# EAGLE design i27_adapt (EAGLE 6.5.0)
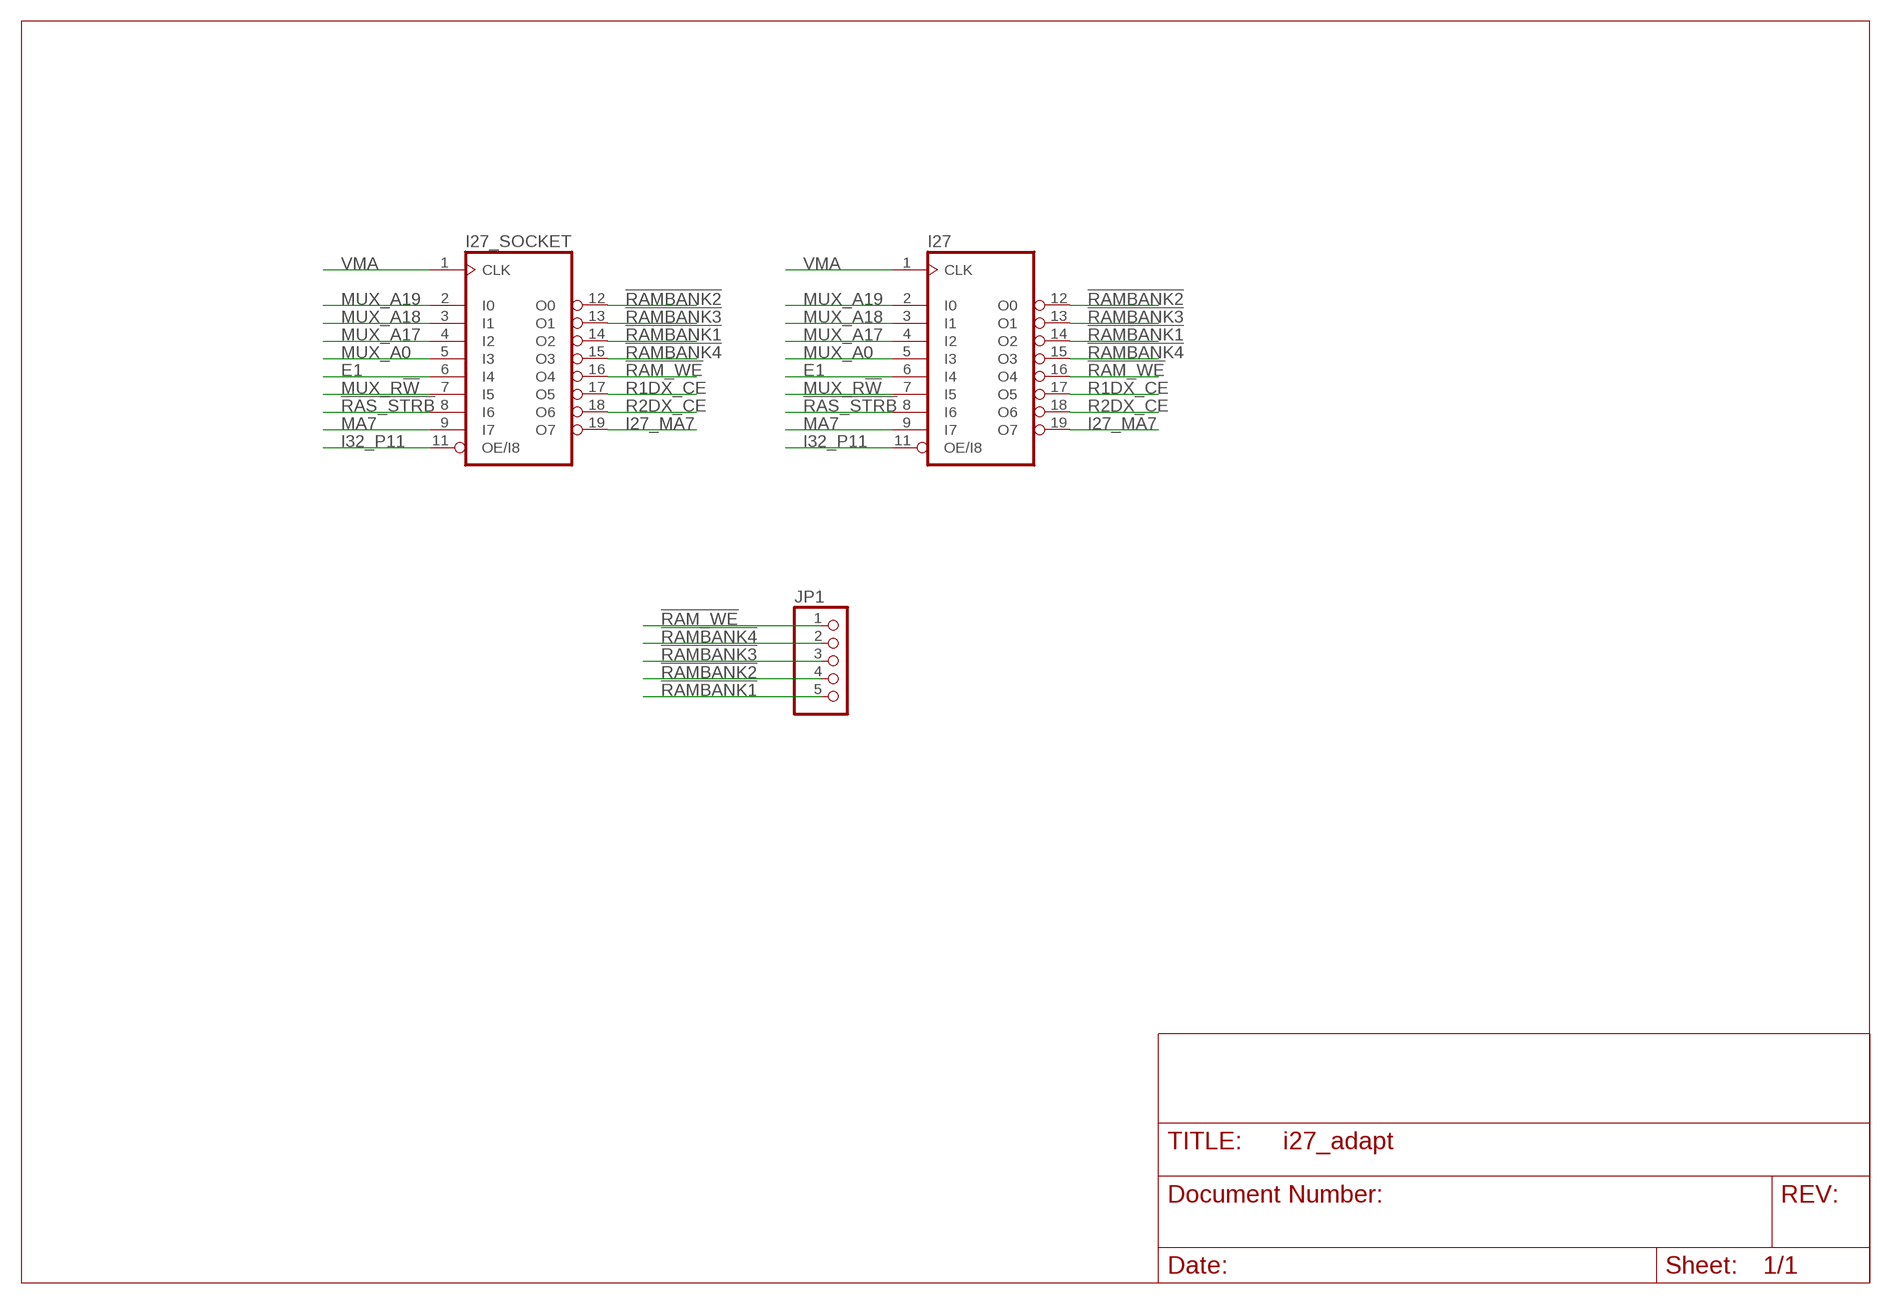
[diagram p0: schematic, sheet 1]

## Parts
I27  16V8-ROUND  [DIL20-R]
I27_SOCKET  16V8-ROUND  [DIL20-R]
JP1  PINHD-1X5/90  [1X05/90]

## Nets
!RAM_WE: I27.16(O4) I27_SOCKET.16(O4) JP1.1
!RAMBANK1: I27.14(O2) I27_SOCKET.14(O2) JP1.5
!RAMBANK2: I27.12(O0) I27_SOCKET.12(O0) JP1.4
!RAMBANK3: I27.13(O1) I27_SOCKET.13(O1) JP1.3
!RAMBANK4: I27.15(O3) I27_SOCKET.15(O3) JP1.2
!RAS_STRB: I27.8(I6) I27_SOCKET.8(I6)
E1: I27.6(I4) I27_SOCKET.6(I4)
I27_MA7: I27.19(O7) I27_SOCKET.19(O7)
I32_P11: I27.11(OE/I8) I27_SOCKET.11(OE/I8)
MA7: I27.9(I7) I27_SOCKET.9(I7)
MUX_A0: I27.5(I3) I27_SOCKET.5(I3)
MUX_A17: I27.4(I2) I27_SOCKET.4(I2)
MUX_A18: I27.3(I1) I27_SOCKET.3(I1)
MUX_A19: I27.2(I0) I27_SOCKET.2(I0)
MUX_R!W!: I27.7(I5) I27_SOCKET.7(I5)
R1DX_CE: I27.17(O5) I27_SOCKET.17(O5)
R2DX_CE: I27.18(O6) I27_SOCKET.18(O6)
VMA: I27.1(CLK) I27_SOCKET.1(CLK)

## Power pins joined to a net without a drawn wire
GND: I27.10(GND) I27_SOCKET.10(GND)
VCC: I27.20(VCC) I27_SOCKET.20(VCC)

## Library data of the parts
I27 I27_SOCKET = pal-phs:16V8: PAL
JP1 = pinhead-round:PINHD-1X5: PIN HEADER

## Board
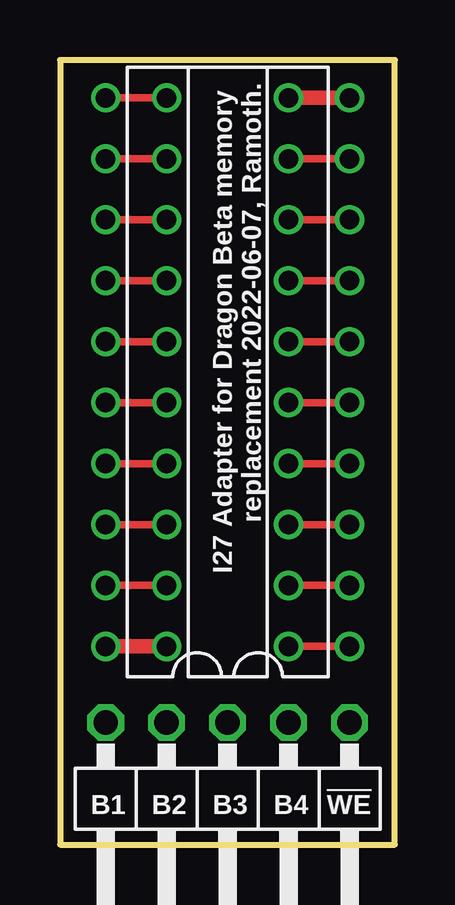
[diagram p1: board, top side]
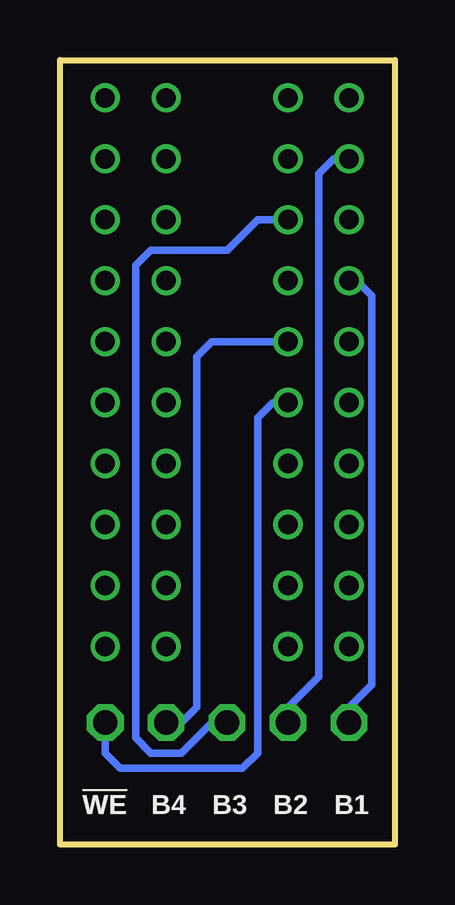
[diagram p2: board, bottom side, seen from below]

Size 13.95 x 32.69 mm. Coordinates in mm from the lower left corner, seen from the top.
Outline: 0,0 13.95,0 13.95,32.69 0,32.69 0,0
Copper layers (1*16): Top 0.035559375mm / dielectric 1.6mm / Bottom 0.035559375mm
Design rules "oshpark-2layer": minimum track width 6mil, minimum drill 10mil, track to track 6mil, track to pad 6mil, pad to pad 6mil, via to via 6mil, smd to smd 6mil, copper to edge 15mil, drill to drill 6mil, minimum pad ring 5mil, minimum via ring 5mil, stop-mask expansion 2.5mil, vias tented up to drill 0mil, thermal gap 10mil

### Footprints (pad centres in the part's own frame; a part is rotated, then mirrored left to right if it is on the bottom)
DIL20-R = drill 0.813: 1 -11.43,-3.81; 2 -8.89,-3.81; 3 -6.35,-3.81; 4 -3.81,-3.81; 5 -1.27,-3.81; 6 1.27,-3.81; 7 3.81,-3.81; 8 6.35,-3.81; 9 8.89,-3.81; 10 11.43,-3.81; 11 11.43,3.81; 12 8.89,3.81; 13 6.35,3.81; 14 3.81,3.81; 15 1.27,3.81; 16 -1.27,3.81; 17 -3.81,3.81; 18 -6.35,3.81; 19 -8.89,3.81; 20 -11.43,3.81
1X05/90 = drill 1.016 octagon: 1 -5.08,-3.81; 2 -2.54,-3.81; 3 0,-3.81; 4 2.54,-3.81; 5 5.08,-3.81

### Placement (x,y rotation side)
I27  5.71,19.68 90 top
I27_SOCKET  8.26,19.68 90 top
JP1  6.99,1.27 180 top

### Tracks (layer width: path | path; a pad name or v marks a point on that pad's centre or on a via)
!RAM_WE
  Top 0.305: I27_SOCKET.16 I27.16
  Bottom 0.305: JP1.1 12.06,3.81 11.43,3.17 6.35,3.17 5.71,3.81 5.71,17.78 5.08,18.41 I27_SOCKET.16
!RAMBANK1
  Top 0.305: I27_SOCKET.14 I27.14
  Bottom 0.305: JP1.5 1.91,5.71 0.95,6.67 0.95,22.86 1.59,23.5 I27.14
!RAMBANK2
  Top 0.305: I27.12 I27_SOCKET.12
  Bottom 0.305: JP1.4 4.45,5.71 3.17,6.99 3.17,27.94 2.54,28.57 I27.12
!RAMBANK3
  Top 0.305: I27_SOCKET.13 I27.13
  Bottom 0.305: JP1.3 7.62,5.08 8.89,3.81 10.16,3.81 10.79,4.45 10.79,24.13 10.16,24.77 6.99,24.77 5.71,26.04 I27_SOCKET.13
!RAMBANK4
  Top 0.305: I27_SOCKET.15 I27.15
  Bottom 0.305: I27_SOCKET.15 7.62,20.95 8.26,20.32 8.26,5.71 8.89,5.08 JP1.2
!RAS_STRB
  Top 0.305: I27_SOCKET.8 I27.8
E1
  Top 0.305: I27_SOCKET.6 I27.6
GND
  Top 0.61: I27_SOCKET.10 I27.10
I27_MA7
  Top 0.305: I27_SOCKET.19 I27.19
I32_P11
  Top 0.305: I27_SOCKET.11 I27.11
MA7
  Top 0.305: I27_SOCKET.9 I27.9
MUX_A0
  Top 0.305: I27_SOCKET.5 I27.5
MUX_A17
  Top 0.305: I27_SOCKET.4 I27.4
MUX_A18
  Top 0.305: I27_SOCKET.3 I27.3
MUX_A19
  Top 0.305: I27_SOCKET.2 I27.2
MUX_R!W!
  Top 0.305: I27_SOCKET.7 I27.7
R1DX_CE
  Top 0.305: I27_SOCKET.17 I27.17
R2DX_CE
  Top 0.305: I27_SOCKET.18 I27.18
VCC
  Top 0.61: I27_SOCKET.20 I27.20
VMA
  Top 0.305: I27_SOCKET.1 I27.1

### Text on the board
tPlace: I27 Adapter for Dragon Beta memory / replacement 2022-06-07, Ramoth. | B1 | B2 | B3 | B4 | !WE
bPlace: B1 | B2 | B3 | B4 | !WE | !WE